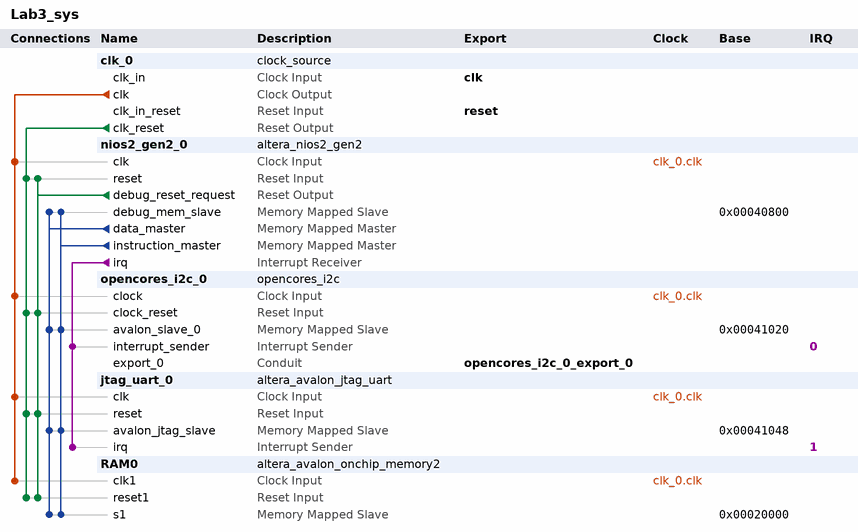
[diagram p0: system contents]
# Platform Designer (Qsys) system Lab3_sys, MAX 10 10M50DAF484C7G
# Parameters at their usual value, and those the tool derives, are not listed.
package require -exact qsys 18.1
create_system Lab3_sys
set_project_property DEVICE_FAMILY {MAX 10}
set_project_property DEVICE 10M50DAF484C7G

add_instance clk_0 clock_source 18.1
set_instance_parameter_value clk_0 clockFrequency 50000000

add_instance nios2_gen2_0 altera_nios2_gen2 18.1
set_instance_parameter_value nios2_gen2_0 dcache_size 2048
set_instance_parameter_value nios2_gen2_0 exceptionSlave RAM0.s1
set_instance_parameter_value nios2_gen2_0 icache_size 4096
set_instance_parameter_value nios2_gen2_0 impl Tiny
set_instance_parameter_value nios2_gen2_0 resetSlave RAM0.s1

add_instance opencores_i2c_0 opencores_i2c 9.1

add_instance jtag_uart_0 altera_avalon_jtag_uart 18.1
set_instance_parameter_value jtag_uart_0 simInteractiveOptions NO_INTERACTIVE_WINDOWS

add_instance RAM0 altera_avalon_onchip_memory2 18.1
set_instance_parameter_value RAM0 dataWidth 32
set_instance_parameter_value RAM0 dualPort false
set_instance_parameter_value RAM0 initMemContent false
set_instance_parameter_value RAM0 initializationFileName onchip_mem.hex
set_instance_parameter_value RAM0 memorySize 100000

# connections
add_connection clk_0.clk jtag_uart_0.clk clock
add_connection clk_0.clk nios2_gen2_0.clk clock
add_connection clk_0.clk opencores_i2c_0.clock clock
add_connection clk_0.clk RAM0.clk1 clock
add_connection clk_0.clk_reset jtag_uart_0.reset reset
add_connection clk_0.clk_reset nios2_gen2_0.reset reset
add_connection clk_0.clk_reset opencores_i2c_0.clock_reset reset
add_connection clk_0.clk_reset RAM0.reset1 reset
add_connection nios2_gen2_0.debug_reset_request jtag_uart_0.reset reset
add_connection nios2_gen2_0.debug_reset_request nios2_gen2_0.reset reset
add_connection nios2_gen2_0.debug_reset_request opencores_i2c_0.clock_reset reset
add_connection nios2_gen2_0.debug_reset_request RAM0.reset1 reset
add_connection nios2_gen2_0.data_master jtag_uart_0.avalon_jtag_slave avalon
set_connection_parameter_value nios2_gen2_0.data_master/jtag_uart_0.avalon_jtag_slave baseAddress 0x00041048
add_connection nios2_gen2_0.data_master nios2_gen2_0.debug_mem_slave avalon
set_connection_parameter_value nios2_gen2_0.data_master/nios2_gen2_0.debug_mem_slave baseAddress 0x00040800
add_connection nios2_gen2_0.data_master opencores_i2c_0.avalon_slave_0 avalon
set_connection_parameter_value nios2_gen2_0.data_master/opencores_i2c_0.avalon_slave_0 baseAddress 0x00041020
add_connection nios2_gen2_0.data_master RAM0.s1 avalon
set_connection_parameter_value nios2_gen2_0.data_master/RAM0.s1 baseAddress 0x00020000
add_connection nios2_gen2_0.instruction_master jtag_uart_0.avalon_jtag_slave avalon
set_connection_parameter_value nios2_gen2_0.instruction_master/jtag_uart_0.avalon_jtag_slave baseAddress 0x00041048
add_connection nios2_gen2_0.instruction_master nios2_gen2_0.debug_mem_slave avalon
set_connection_parameter_value nios2_gen2_0.instruction_master/nios2_gen2_0.debug_mem_slave baseAddress 0x00040800
add_connection nios2_gen2_0.instruction_master opencores_i2c_0.avalon_slave_0 avalon
set_connection_parameter_value nios2_gen2_0.instruction_master/opencores_i2c_0.avalon_slave_0 baseAddress 0x00041020
add_connection nios2_gen2_0.instruction_master RAM0.s1 avalon
set_connection_parameter_value nios2_gen2_0.instruction_master/RAM0.s1 baseAddress 0x00020000
add_connection nios2_gen2_0.irq jtag_uart_0.irq interrupt
set_connection_parameter_value nios2_gen2_0.irq/jtag_uart_0.irq irqNumber 1
add_connection nios2_gen2_0.irq opencores_i2c_0.interrupt_sender interrupt
set_connection_parameter_value nios2_gen2_0.irq/opencores_i2c_0.interrupt_sender irqNumber 0

# exported interfaces
add_interface clk clock sink
set_interface_property clk EXPORT_OF clk_0.clk_in
add_interface opencores_i2c_0_export_0 conduit end
set_interface_property opencores_i2c_0_export_0 EXPORT_OF opencores_i2c_0.export_0
add_interface reset reset sink
set_interface_property reset EXPORT_OF clk_0.clk_in_reset

set_interconnect_requirement {$system} qsys_mm.clockCrossingAdapter HANDSHAKE
set_interconnect_requirement {$system} qsys_mm.enableEccProtection FALSE
set_interconnect_requirement {$system} qsys_mm.insertDefaultSlave FALSE
set_interconnect_requirement {$system} qsys_mm.maxAdditionalLatency 1

save_system Lab3_sys.qsys
